# EAGLE design PulseOxi (EAGLE 9.6.2)
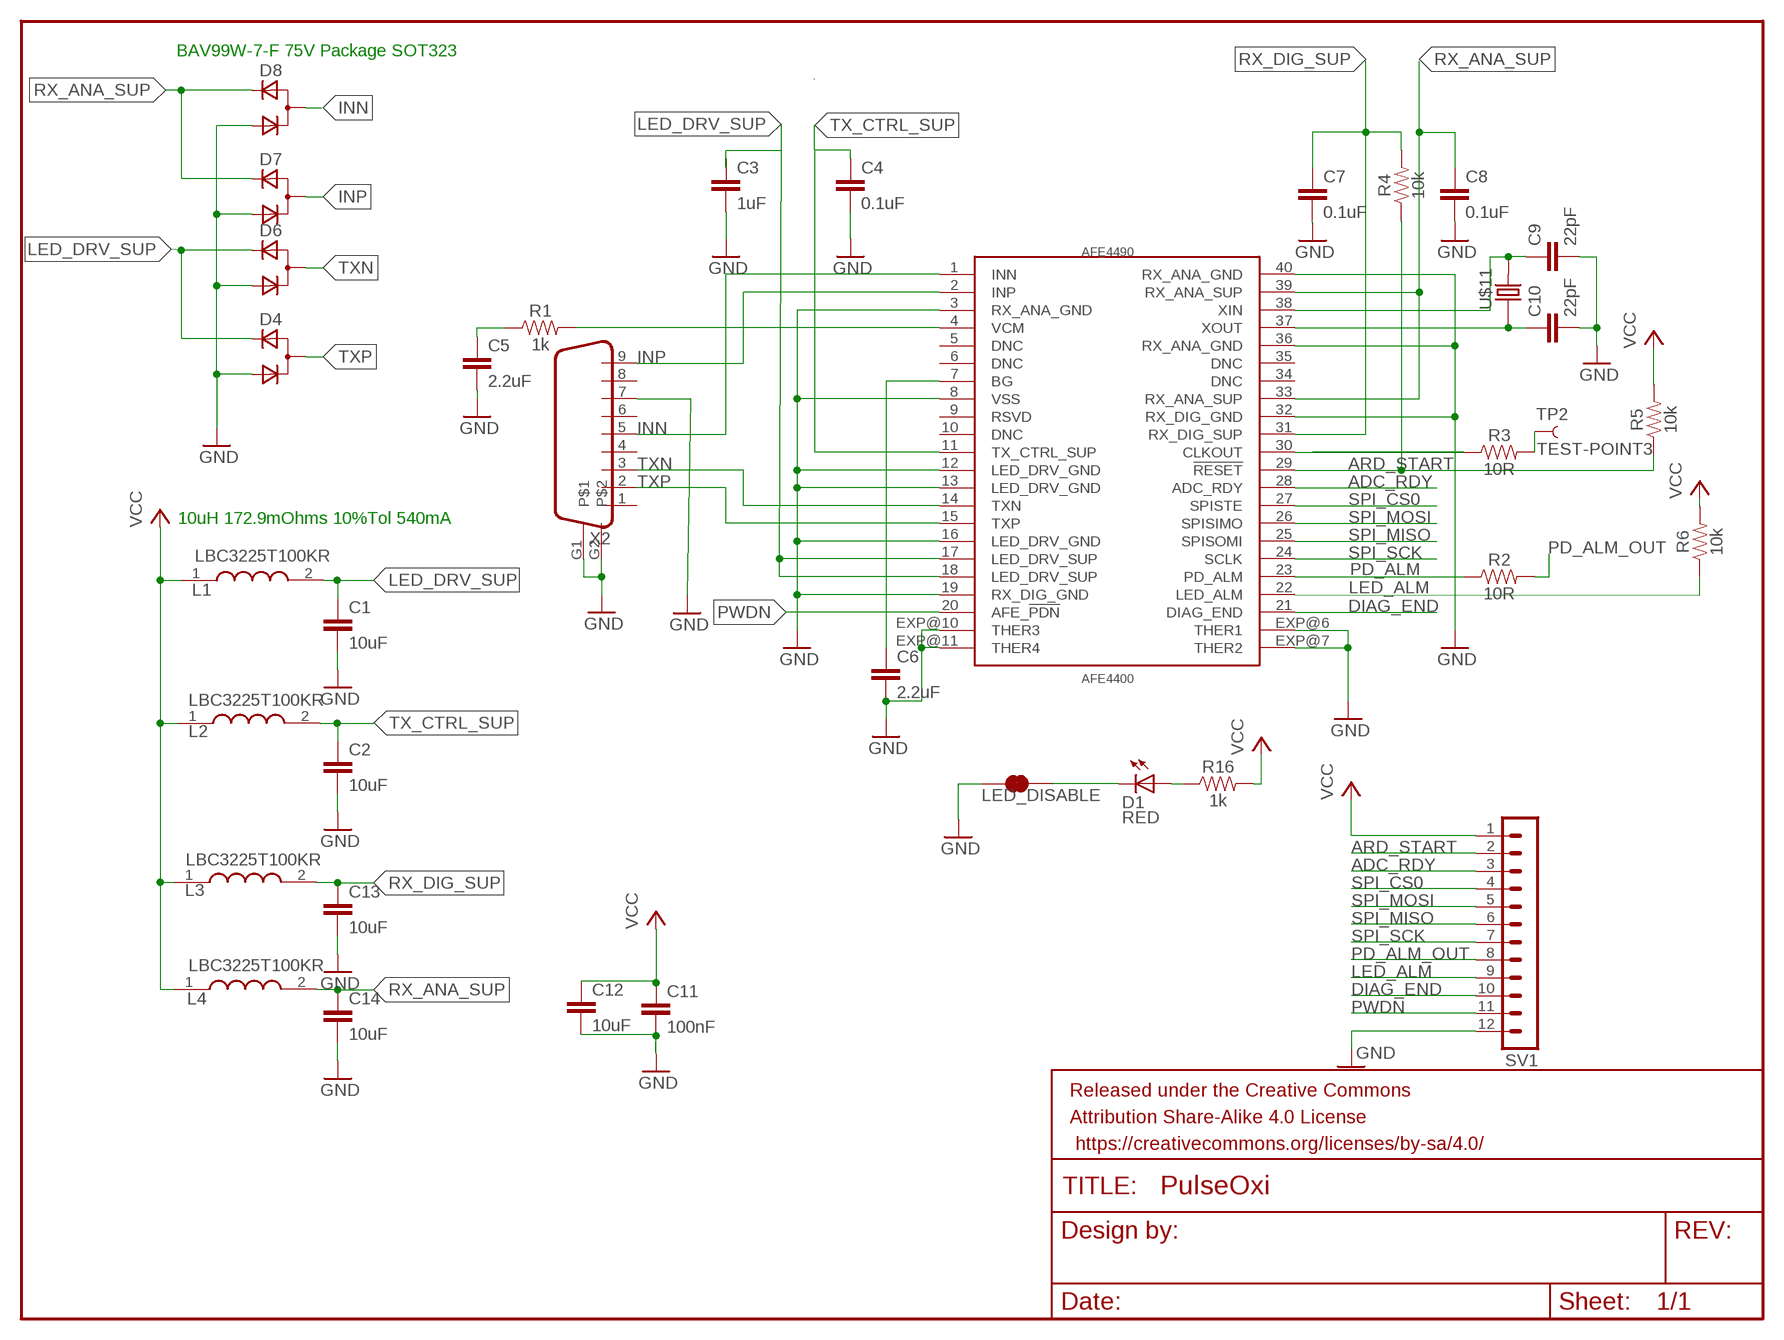
[diagram p0: schematic, sheet 1]

## Parts
AFE4490  AFE4400  [QFN-40]
C1  10uF  27PF-0603-50V-5%  [0603]
C2  10uF  27PF-0603-50V-5%  [0603]
C3  1uF  27PF-0603-50V-5%  [0603]
C4  0.1uF  27PF-0603-50V-5%  [0603]
C5  2.2uF  27PF-0603-50V-5%  [0603]
C6  2.2uF  27PF-0603-50V-5%  [0603]
C7  0.1uF  27PF-0603-50V-5%  [0603]
C8  0.1uF  27PF-0603-50V-5%  [0603]
C9  22pF  27PF-0603-50V-5%  [0603]
C10  22pF  27PF-0603-50V-5%  [0603]
C11  100nF  27PF-0603-50V-5%  [0603]
C12  10uF  27PF-0603-50V-5%  [0603]
C13  10uF  27PF-0603-50V-5%  [0603]
C14  10uF  27PF-0603-50V-5%  [0603]
D1  RED  LED-RED0603  [LED-0603]
D4  D_ACACSOT323  [SOT323]
D6  D_ACACSOT323  [SOT323]
D7  D_ACACSOT323  [SOT323]
D8  D_ACACSOT323  [SOT323]
FRAME1  FRAME-LETTERNO_PACKAGE  [DUMMY]
L1  LBC3225T100KR  [INDC3225X270N]
L2  LBC3225T100KR  [INDC3225X270N]
L3  LBC3225T100KR  [INDC3225X270N]
L4  LBC3225T100KR  [INDC3225X270N]
LED_DISABLE  JUMPER-SMT_2_NC_TRACE_SILK  [SMT-JUMPER_2_NC_TRACE_SILK]
R1  1k  1KOHM-0603-1/10W-1%  [0603]
R2  10R  1.8MOHM  [0603]
R3  10R  1.8MOHM  [0603]
R4  10k  1.8MOHM  [0603]
R5  10k  1.8MOHM  [0603]
R6  10k  1.8MOHM  [0603]
R16  1k  1KOHM-0603-1/10W-1%  [0603]
SV1  MA12-1  [MA12-1]
TP2  TEST-POINT3  [PAD.03X.03]
U$11  ABM3  [ABM3]
X2  DB9  [DB9]

## Nets
ADC_RDY: AFE4490.28(ADC_RDY) SV1.3
ARD_START: AFE4490.29(!RESET) R4.1 R5.1 SV1.2
DIAG_END: AFE4490.21(DIAG_END) SV1.10
GND: AFE4490.3(RX_ANA_GND) AFE4490.8(VSS) AFE4490.12(LED_DRV_GND) AFE4490.13(LED_DRV_GND) AFE4490.16(LED_DRV_GND) AFE4490.19(RX_DIG_GND) AFE4490.32(RX_DIG_GND) AFE4490.36(RX_ANA_GND) AFE4490.40(RX_ANA_GND) AFE4490.EXP@6(THER1) AFE4490.EXP@7(THER2) AFE4490.EXP@10(THER3) AFE4490.EXP@11(THER4) C1.2 C2.2 C3.2 C4.2 C5.2 C6.2 C7.2 C8.2 C9.2 C10.2 C11.2 C12.2 C13.2 C14.2 D4.2(C) D6.2(C) D7.2(C) D8.2(C) LED_DISABLE.1 SV1.12 X2.7 X2.G1 X2.G2
INN: AFE4490.1(INN) D8.1(CA) X2.5
INP: AFE4490.2(INP) D7.1(CA) X2.9
LED_ALM: AFE4490.22(LED_ALM) R6.1 SV1.9
LED_DRV_SUP: AFE4490.17(LED_DRV_SUP) AFE4490.18(LED_DRV_SUP) C1.1 C3.1 D4.3(A) D6.3(A) L1.2
N$1: R3.2 TP2.P$1
N$4: AFE4490.30(CLKOUT) R3.1
N$5: AFE4490.4(VCM) R1.2
N$6: C5.1 R1.1
N$16: AFE4490.38(XIN) C9.1 U$11.2
N$19: AFE4490.37(XOUT) C10.1 U$11.1
N$20: AFE4490.7(BG) C6.1
N$26: D1.A R16.1
N$28: D1.C LED_DISABLE.2
PD_ALM: AFE4490.23(PD_ALM) R2.1
PD_ALM_OUT: R2.2 SV1.8
PWDN: AFE4490.20(AFE_!PDN) SV1.11
RX_ANA_SUP: AFE4490.33(RX_ANA_SUP) AFE4490.39(RX_ANA_SUP) C8.1 C14.1 D7.3(A) D8.3(A) L4.2
RX_DIG_SUP: AFE4490.31(RX_DIG_SUP) C7.1 C13.1 L3.2 R4.2
SPI_CS0: AFE4490.27(SPISTE) SV1.4
SPI_MISO: AFE4490.25(SPISOMI) SV1.6
SPI_MOSI: AFE4490.26(SPISIMO) SV1.5
SPI_SCK: AFE4490.24(SCLK) SV1.7
TX_CTRL_SUP: AFE4490.11(TX_CTRL_SUP) C2.1 C4.1 L2.2
TXN: AFE4490.14(TXN) D6.1(CA) X2.3
TXP: AFE4490.15(TXP) D4.1(CA) X2.2
VCC: C11.1 C12.1 L1.1 L2.1 L3.1 L4.1 R5.2 R6.2 R16.2 SV1.1
Unconnected: AFE4490.5(DNC) AFE4490.6(DNC) AFE4490.9(RSVD) AFE4490.10(DNC) AFE4490.34(DNC) AFE4490.35(DNC) X2.1 X2.4 X2.6 X2.8

## Notes on the sheet
- BAV99W-7-F 75V Package SOT323
- 10uH 172.9mOhms 10%Tol 540mA

## Library data of the parts
AFE4490 = circuitects:AFE4400
C1-C14 = SparkFun-Capacitors:27PF: 27pF ceramic capacitors A capacitor is a passive two-terminal electrical component used to store electrical energy temporarily in an electric field.; PROD_ID: CAP-09989; VALUE: 27pF
D1 = SparkFun-LED:LED-RED: Assorted Red LEDs LilyPad 1206- DIO-09912 1206- DIO-00809 0603- DIO-00819; PROD_ID: DIO-00819
D4 D6-D8 = zetex:D_ACAC: Dual DIODE; OC_FARNELL: unknown; OC_NEWARK: unknown
FRAME1 = SparkFun-Aesthetics:FRAME-LETTER: Schematic Frame - Letter Standard 8.5x11 US Letter frame; DESIGNER: Nobody; VERSION: v01
L1-L4 = LBC3225T100KR:LBC3225T100KR: TAIYO YUDEN - LBC3225T100KR - INDUCTOR, 10UH, 540MA, 10%, 23MHz Source: Datasheet <https://ds.yuden.co.jp/TYCOMPAS/ut/detail?pn=LBC3225T100KR &u=M>; DESCRIPTION: TAIYO YUDEN - LBC3225T100KR - INDUCTOR, 10UH, 540MA, 10%, 23MHz; HEIGHT: 2.7mm; MANUFACTURER_NAME: TAIYO YUDEN; MANUFACTURER_PART_NUMBER: LBC3225T100KR; MOUSER_PART_NUMBER: 963-LBC3225T100KR; MOUSER_PRICE-STOCK: https://www.mouser.co.uk/ProductDetail/TAIYO-YUDEN/LBC3225T100KR?qs=PzICbMaShUfZVMW%252BOICEZw%3D%3D
LED_DISABLE = SparkFun-Jumpers:JUMPER-SMT_2_NC_TRACE: Normally closed trace jumper This jumper has a trace between two pads so it's normally closed (NC). Use a razor knife to open the connection. For best results follow the IPC guidelines for cutting traces: Cutout at least 0.063 mm (0.005 in). Remove all loose material to clean up the cut area. Seal the cut with an approved epoxy. Reapply solder to reclose the connection.
R1 R16 = SparkFun-Resistors:1KOHM: 1kΩ resistor A resistor is a passive two-terminal electrical component that implements electrical resistance as a circuit element. Resistors act to reduce current flow, and, at the same time, act to lower voltage levels within circuits. - Wikipedia; PROD_ID: RES-07856
R2-R6 = SparkFun-Resistors:1.8MOHM: 1.8 MOhms ±5% 0.1W, 1/10W Chip Resistor 0603; PROD_ID: RES-13994; VALUE: 1.8M
SV1 = con-lstb:MA12-1: PIN HEADER; OC_FARNELL: unknown; OC_NEWARK: unknown
TP2 = SparkFun:TEST-POINT
U$11 = circuitects:ABM3
X2 = circuitects:DB9: DB9 Connector Standard DB9 (D-Sub 9) serial connector. Can be used for CAN bus as well as RS485 and RS232. Footprint production proven. Spark Fun Electronics SKU : PRT-00429

## Board
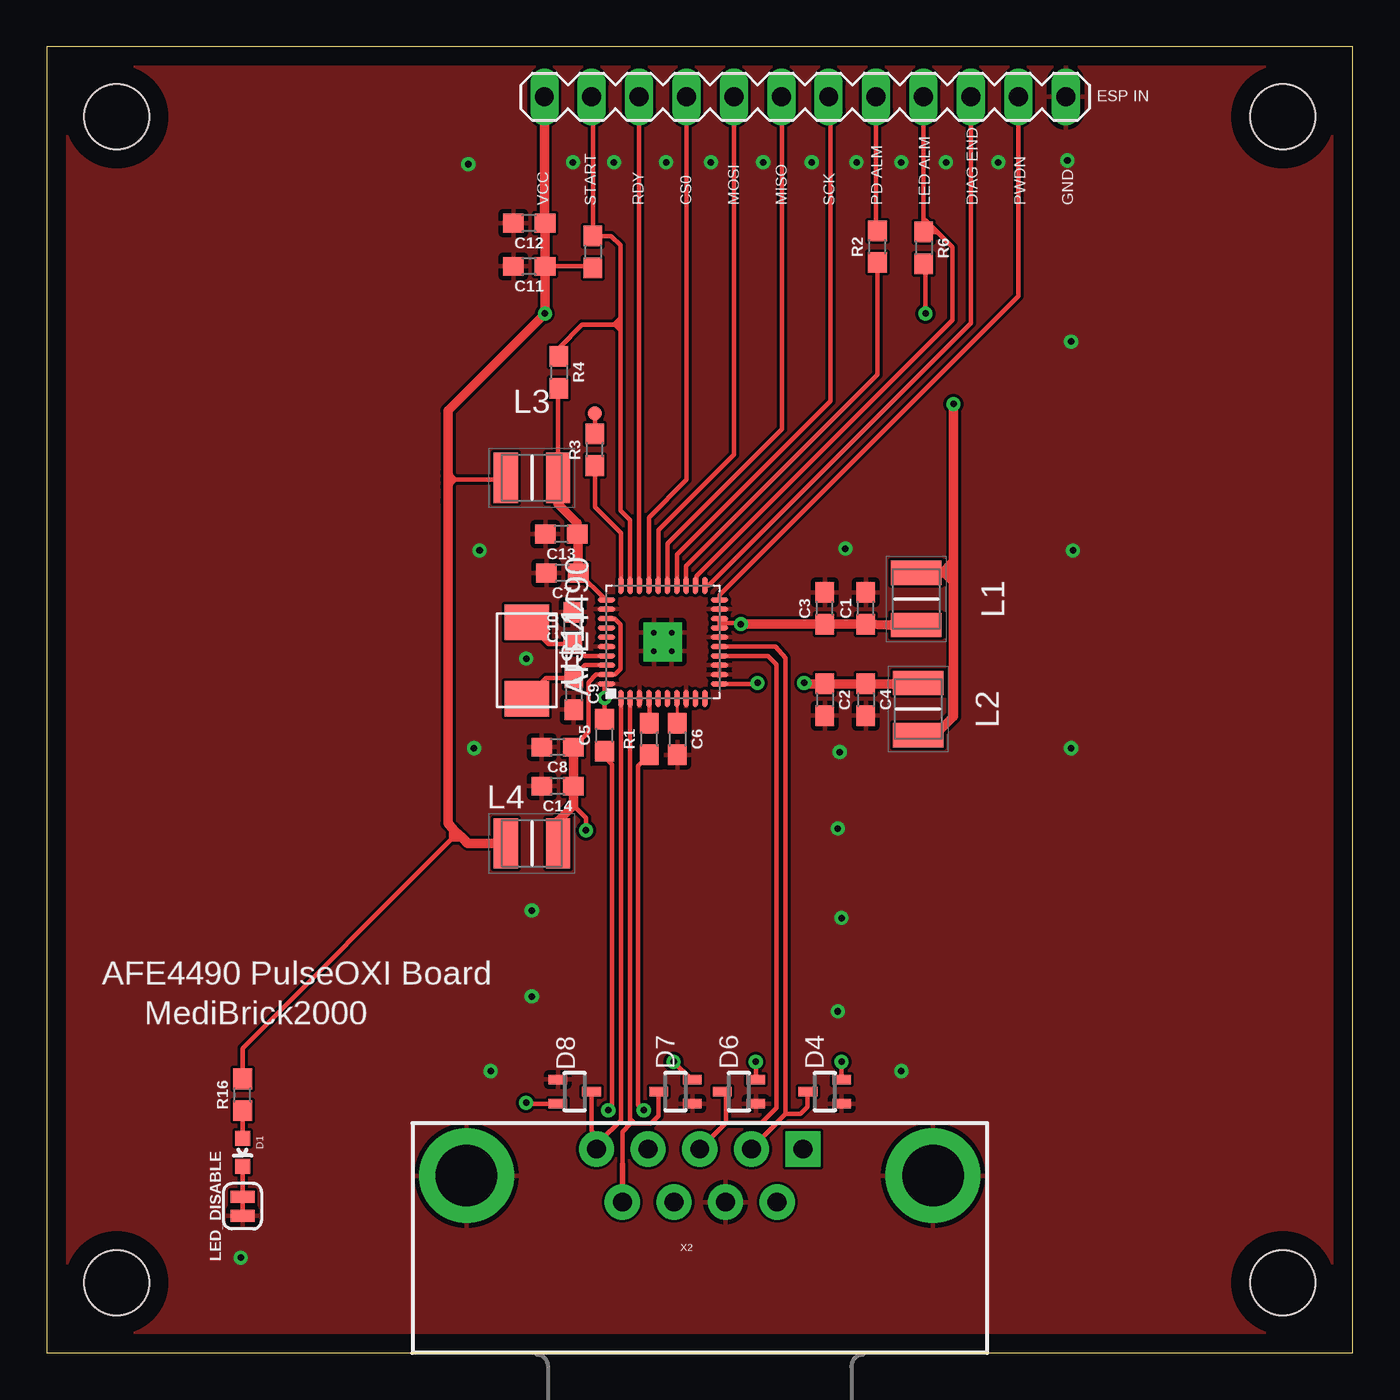
[diagram p1: board, top side]
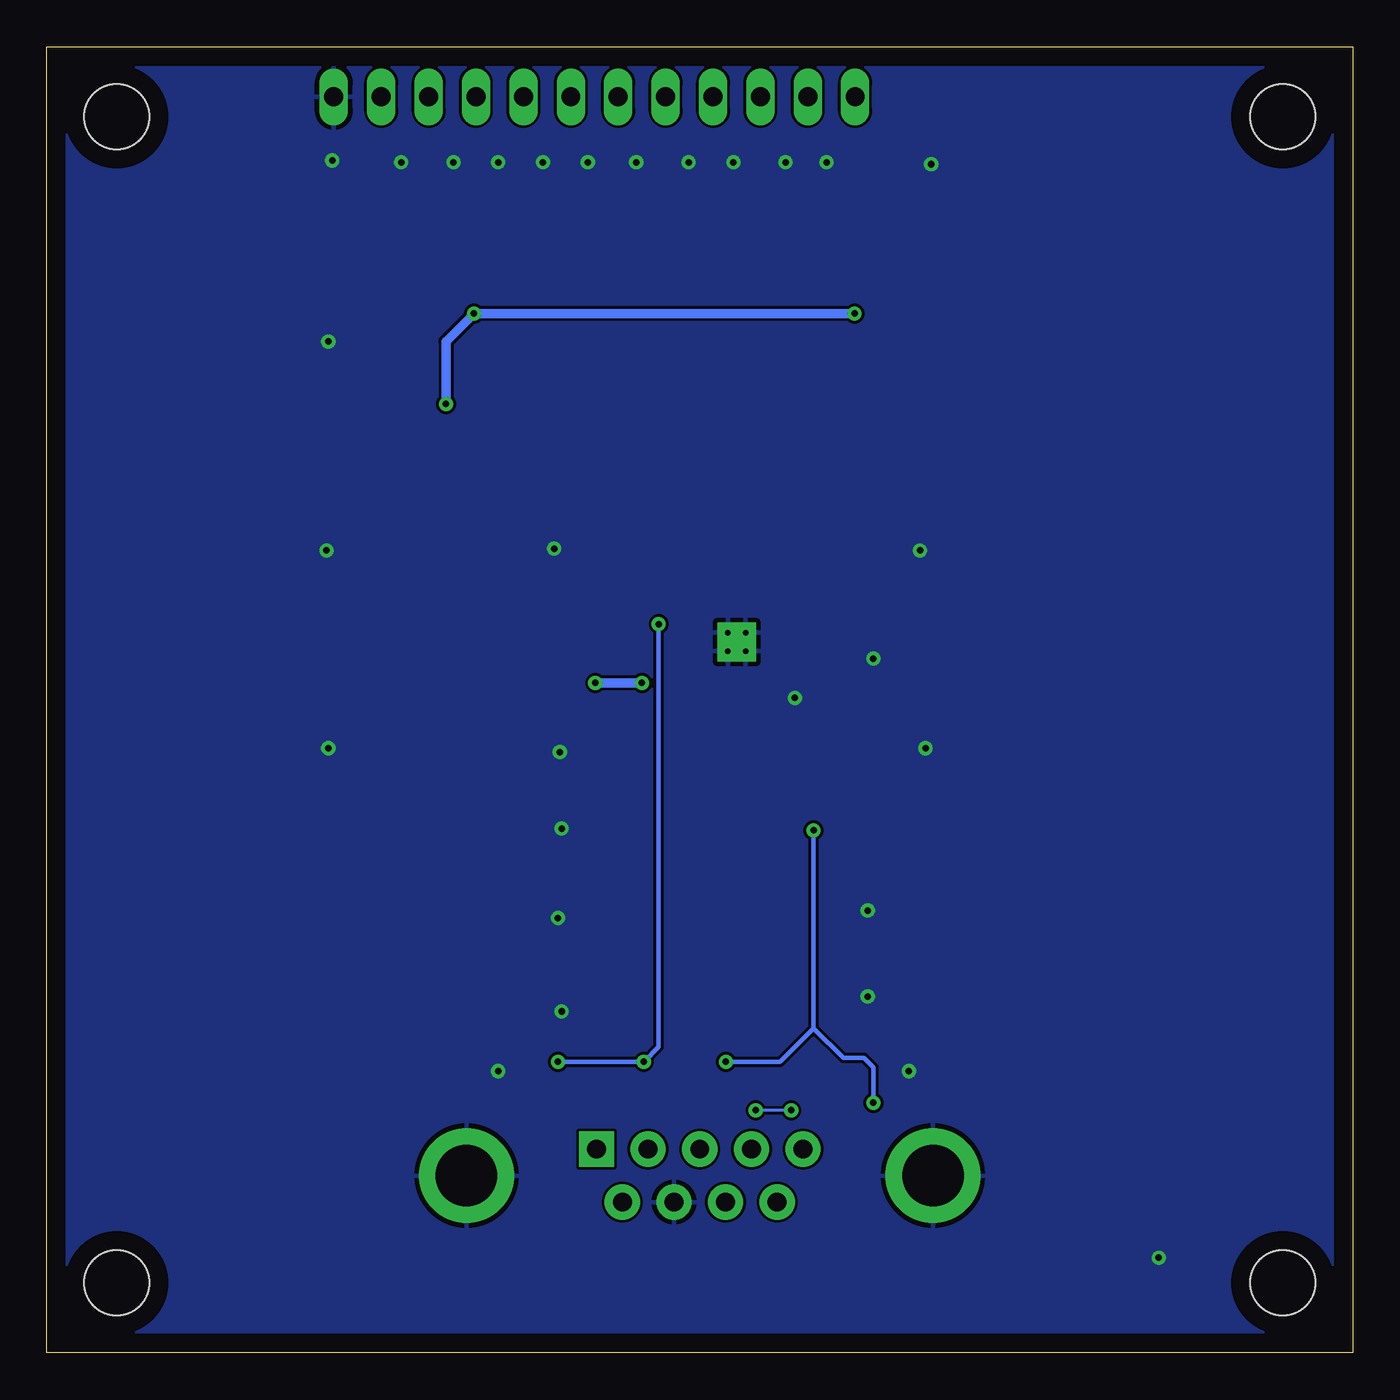
[diagram p2: board, bottom side, seen from below]

Size 70 x 70 mm. Coordinates in mm from the lower left corner, seen from the top.
Outline: 0,0 70,0 70,70 0,70 0,0
Copper layers (1*16): Top 0.035mm / dielectric 1.5mm / Bottom 0.035mm
Design rules "default": minimum track width 6mil, minimum drill 0.35mm, track to track 6mil, track to pad 6mil, pad to pad 6mil, via to via 6mil, smd to smd 6mil, copper to edge 40mil, drill to drill 6mil, minimum pad ring 10mil, minimum via ring 8mil, stop-mask expansion 4mil, vias tented up to drill 0mil, thermal gap 10mil
Holes 3.5 mm at 3.75,66.25 66.25,66.25 3.75,3.75 66.25,3.75

### Footprints (pad centres in the part's own frame; a part is rotated, then mirrored left to right if it is on the bottom)
QFN-40 = smd 0.95 x 0.28: 1 -3.025,2.25; 2 -3.025,1.75; 3 -3.025,1.25; 4 -3.025,0.75; 5 -3.025,0.25; 6 -3.025,-0.25; 7 -3.025,-0.75; 8 -3.025,-1.25; 9 -3.025,-1.75; 10 -3.025,-2.25; 21 3.025,-2.25; 22 3.025,-1.75; 23 3.025,-1.25; 24 3.025,-0.75; 25 3.025,-0.25; 26 3.025,0.25; 27 3.025,0.75; 28 3.025,1.25; 29 3.025,1.75; 30 3.025,2.25 | smd 0.28 x 0.95: 11 -2.25,-3.025; 12 -1.75,-3.025; 13 -1.25,-3.025; 14 -0.75,-3.025; 15 -0.25,-3.025; 16 0.25,-3.025; 17 0.75,-3.025; 18 1.25,-3.025; 19 1.75,-3.025; 20 2.25,-3.025; 31 2.25,3.025; 32 1.75,3.025; 33 1.25,3.025; 34 0.75,3.025; 35 0.25,3.025; 36 -0.25,3.025; 37 -0.75,3.025; 38 -1.25,3.025; 39 -1.75,3.025; 40 -2.25,3.025 | drill 0.3 pad 1.1 square: EXP@6 -0.5,0.475; EXP@7 0.5,0.475; EXP@10 -0.5,-0.475; EXP@11 0.5,-0.475
0603 = smd 1.1 x 1: 1 -0.85,0; 2 0.85,0
LED-0603 = smd 0.8 x 0.8: A 0,-0.75; C 0,0.75
SOT323 = smd 0.5 x 1: 1 0,0.9; 2 -0.65,-0.9; 3 0.65,-0.9
INDC3225X270N = smd 1.3 x 2.7: 1 -1.4,0; 2 1.4,0
SMT-JUMPER_2_NC_TRACE_SILK = smd 0.635 x 1.27: 1 -0.508,0; 2 0.508,0
MA12-1 = drill 1.016 long: 1 -13.97,0; 2 -11.43,0; 3 -8.89,0; 4 -6.35,0; 5 -3.81,0; 6 -1.27,0; 7 1.27,0; 8 3.81,0; 9 6.35,0; 10 8.89,0; 11 11.43,0; 12 13.97,0
PAD.03X.03 = smd 0.762 x 0.762: P$1 0,0
ABM3 = smd 1.9 x 2.4: 1 -2.05,0; 2 2.05,0
DB9 = drill 1.016 pad 1.88 square: 1 -5.54,-1.42 | drill 1.016 pad 1.88: 2 -2.77,-1.42; 3 0,-1.42; 4 2.77,-1.42; 5 5.54,-1.42; 6 -4.15,1.42; 7 -1.38,1.42; 8 1.38,1.42; 9 4.15,1.42 | drill 3.302 pad 5.08: G1 -12.5,0; G2 12.5,0

### Placement (x,y rotation side)
AFE4490  33.02,38.1 90 top
C1  43.9,39.9 90 top
C2  41.7,35 270 top
C3  41.7,39.9 90 top
C4  43.9,35 270 top
C5  29.9,33.1 90 top
C6  33.8,32.9 270 top
C7  27.63,41.79 180 top
C8  27.38,32.46 180 top
C9  28.24,35.32 270 top
C10  28.2,38.84 90 top
C11  25.86,58.23 180 top
C12  25.86,60.54 180 top
C13  27.58,43.88 180 top
C14  27.38,30.37 180 top
D1  10.5,10.75 180 top
D4  41.7,14 90 top
D6  37.1,14 90 top
D7  33.7,14 90 top
D8  28.3,14 270 top
FRAME1  -14.5,-19.7 0 top  (outside the outline)
L1  46.6,40.4 270 top
L2  46.7,34.5 90 top
L3  26,46.9 0 top
L4  26,27.3 0 top
LED_DISABLE  10.5,7.86 90 top
R1  32.3,32.9 90 top
R2  44.52,59.28 90 top
R3  29.38,48.4 90 top
R4  27.45,52.55 270 top
R5  29.27,59 270 top
R6  47,59.21 270 top
R16  10.5,13.83 90 top
SV1  40.64,67.31 0 top
TP2  29.38,50.34 0 top
U$11  25.73,37.11 270 top
X2  35,9.5 180 top

### Tracks (layer width: path | path; a pad name or v marks a point on that pad's centre or on a via)
ADC_RDY
  Top 0.152: 31.75,41.15 AFE4490.28
  Top 0.254: 31.75,41.15 31.75,50.21 SV1.3
ARD_START
  Top 0.254: AFE4490.29 31.27,44.63 30.75,45.15 30.75,54.8 | SV1.2 29.27,67.25 R5.1 30.25,59.85 30.75,59.35 30.75,55.45 | 30.75,54.8 30.75,55.45 | R4.1 27.45,53.85 28.7,55.1 30.4,55.1 | 30.4,55.1 30.45,55.1 30.75,54.8 | 30.4,55.1 30.75,55.45
DIAG_END
  Top 0.254: AFE4490.21 35.47,41.12 49.53,55.19 SV1.10
GND  (via drill 0.35)
  Top 0.254: C5.2 29.9,35.76 AFE4490.40
  other vias: 23.2,43 22.9,32.4 25.7,37.2 29.9,35.1 42.6,23.3 42.4,28.1 42.5,32.2 42.8,43.1 55,43 54.9,32.4 54.9,54.2 54.7,63.9 51,63.8 48.2,63.8 45.8,63.8 43.4,63.8 41,63.8 38.4,63.8 35.6,63.8 33.2,63.8 30.4,63.8 28.2,63.8 22.6,63.7 42.4,18.3 45.8,15.1 23.8,15.1 26,19.1 26,23.7 10.4,5.1
  pour Top: 0,70 0,0 69.85,0 69.85,69.85
  pour Bottom: 0,70 0,0 0.6,0 69.85,0 69.85,69.85
  cutout Top: 31.6,34.5 34.5,34.5 34.5,32.9 33,32.9 33,31.3 31.6,31.3
  cutout Top: 29.2,35.5 30.6,35.5 30.6,31.5 29.2,31.5
INN
  Top 0.254: AFE4490.1 30.77,12.47 29.66,11.36 29.46,10.94 X2.5 29.46,11.64 29.2,11.9 D8.1
INP
  Top 0.254: 32.83,13.98 D7.1 32.8,12.7 32.4,12.3 31.5,12.3 | 30.85,10.1 30.85,11.85 31.3,12.3 | AFE4490.2 31.27,12.6 31.27,12.53 | 31.27,12.53 31.27,12.3 31.3,12.3 | 31.3,12.3 31.5,12.3 | 31.5,12.3 31.27,12.53
  Top 0.305: 30.85,10.1 X2.9
LED_ALM
  Top 0.254: AFE4490.22 34.82,41.17 34.82,41.62 48.55,55.35 48.55,59.25 47.74,60.06 | SV1.9 46.99,60.7 | 46.99,60.7 46.99,60.29 46.8,60.1 | 47.74,60.06 R6.1 | 47.74,60.06 47.1,60.7 46.99,60.7
LED_DRV_SUP  (via drill 0.35)
  Top 0.254: D6.3 v38,15.6 | D4.3 v42.6,15.6 | AFE4490.18 36.05,39.1 | 36.05,39.1 AFE4490.17 | 36.05,39.1 37,39.1 37.05,39.05 v37.2,39.05
  Top 0.508: v37.2,39.05 C3.1 C1.1 45.05,39.01 45.06,39 L1.2
  Bottom 0.254: v42.6,15.6 v38,15.6 37.2,16.4 v37.2,39.05
N$1
  Top 0.254: TP2.P$1 R3.2
N$4
  Top 0.254: AFE4490.30 30.77,43.93 29.38,45.32 R3.1
N$5
  Top 0.254: R1.2 32.3,35.05 AFE4490.4
N$6  (via drill 0.35)
  Top 0.254: R1.1 31.7,31.45 31.7,13.3 v32,13 32,13.04 | v30.1,13 30.3,13.2 30.3,31.53 29.9,31.95 C5.1
  Bottom 0.152: v30.1,13 v32,13
N$16
  Top 0.254: AFE4490.38 28.85,36.85 28.24,36.24 C9.1 26.77,36.17 25.73,35.13 U$11.2
N$19
  Top 0.254: AFE4490.37 28.84,37.35 C10.1 26.9,37.99 U$11.1
N$20
  Top 0.152: AFE4490.7 33.78,35.06 33.78,33.74 C6.1
N$26
  Top 0.254: D1.A R16.1
N$28
  Top 0.254: LED_DISABLE.2 D1.C
PD_ALM
  Top 0.152: AFE4490.23 34.29,41.15
  Top 0.254: AFE4490.23 34.27,42.17 44.52,52.42 R2.1
PD_ALM_OUT
  Top 0.254: SV1.8 44.45,60.2 R2.2
PWDN
  Top 0.254: AFE4490.20 36.05,40.6 52.07,56.62 SV1.11
RX_ANA_SUP  (via drill 0.35)
  Top 0.254: AFE4490.33 30.42,39.35 30.75,39.02 30.75,36.65 30.45,36.35 AFE4490.39 29.45,36.35 29.03,35.93 29.03,33.26 C8.1 | D8.3 25.75,13.35 v25.7,13.4 | D7.3 34.55,14.65 v33.6,15.6 | 28.23,29.33 28.9,28.66 v28.9,28
  Top 0.508: C14.1 28.36,30.5 | C14.1 28.23,29.33 27.4,28.5 L4.2 | C8.1 C14.1
  Bottom 0.254: v28.9,28 28.9,17.4 | 28.9,17.4 27.3,15.8 26.2,15.8 25.7,15.3 v25.7,13.4 | v33.6,15.6 30.7,15.6 28.9,17.4
RX_DIG_SUP
  Top 0.152: 30,40.39 AFE4490.31
  Top 0.2: 29.92,40.39 30,40.39
  Top 0.254: C7.1 28.51,41.79 29.92,40.39 | R4.2 27.4,51.41 L3.2
  Top 0.508: C7.1 28.48,43.83 C13.1 28.43,44.47 27.4,45.5 L3.2
SPI_CS0
  Top 0.254: AFE4490.27 32.27,44.77 34.3,46.8 SV1.4
SPI_MISO
  Top 0.254: AFE4490.25 33.27,43.37 39.4,49.5 39.4,67.28 SV1.6
SPI_MOSI
  Top 0.152: AFE4490.26
  Top 0.254: SV1.5 36.83,48.13 32.8,44.1 32.8,41.4 32.77,41.37 AFE4490.26
SPI_SCK
  Top 0.254: SV1.7 42,67.22 42,51 33.77,42.77 AFE4490.24
TX_CTRL_SUP  (via drill 0.35)
  Top 0.254: 41.68,35.85 C2.1 | AFE4490.11 38.05,35.85 v38.1,35.9
  Top 0.508: 43.94,35.86 C4.1 | C4.1 41.75,35.84 C2.1 40.65,35.85 v40.6,35.9 | C4.1 46.65,35.85 L2.2
  Bottom 0.508: v38.1,35.9 v40.6,35.9
TXN
  Top 0.254: AFE4490.14 38.65,37.35 39.1,36.9 39.1,13.12 38.3,12.32 38.02,12.32 38,12.32 36.4,12.32 | X2.3 36.4,12.32 | 36.4,12.32 36.4,13.8 D6.1
TXP
  Top 0.254: AFE4490.15 39.05,37.85 39.6,37.23 39.6,12.82 | 39.6,12.82 X2.2 37.79,10.92 | D4.1 40.77,13.9 40.77,13.17 40.4,12.8 39.69,12.8 39.6,12.82 | 39.6,12.82 39.69,12.82
VCC  (via drill 0.35)
  Top 0.254: R16.2 10.5,16.33 21.69,27.51 | R5.2 29.19,58.23 C11.1 | R6.2 47.1,58.26 v47.1,55.7 | L3.1 24.5,46.8 21.9,46.8 | 21.9,46.8 21.5,46.8 | 21.9,46.8 21.5,47.2 | 21.9,46.8 21.5,46.4 | 21.69,27.51 22.02,27.85 | 21.69,27.51 21.69,27.99 21.78,28.08 | 21.69,27.51 22.31,27.51 22.33,27.53 | 21.5,45.7 21.5,45.6
  Top 0.508: 21.5,45.6 21.5,28.36 21.78,28.08 22.02,27.85 22.33,27.53 22.56,27.3 L4.1 | SV1.1 26.67,60.58 C12.1 C11.1 v26.71,55.71 v26.7,55.7 21.5,50.5 21.5,47.2 21.5,46.8 21.5,46.4 21.5,45.7 | v48.6,50.85 48.64,50.81 | v48.6,50.85 48.6,42.4 48,41.8 L1.1 48.1,41.8 48.6,41.3 | v48.6,50.85 48.6,41.3 | 48.6,41.3 48.6,34.1 47.6,33.1 L2.1
  Bottom 0.508: v26.7,55.7 v47.1,55.7 48.6,54.2 v48.6,50.85 48.6,50.75

### Text on the board
tNames: ESP IN | VCC | START | RDY | CS0 | MOSI | MISO | SCK | PD ALM | LED ALM | DIAG END | PWDN | GND | AFE4490 PulseOXI Board | MediBrick2000